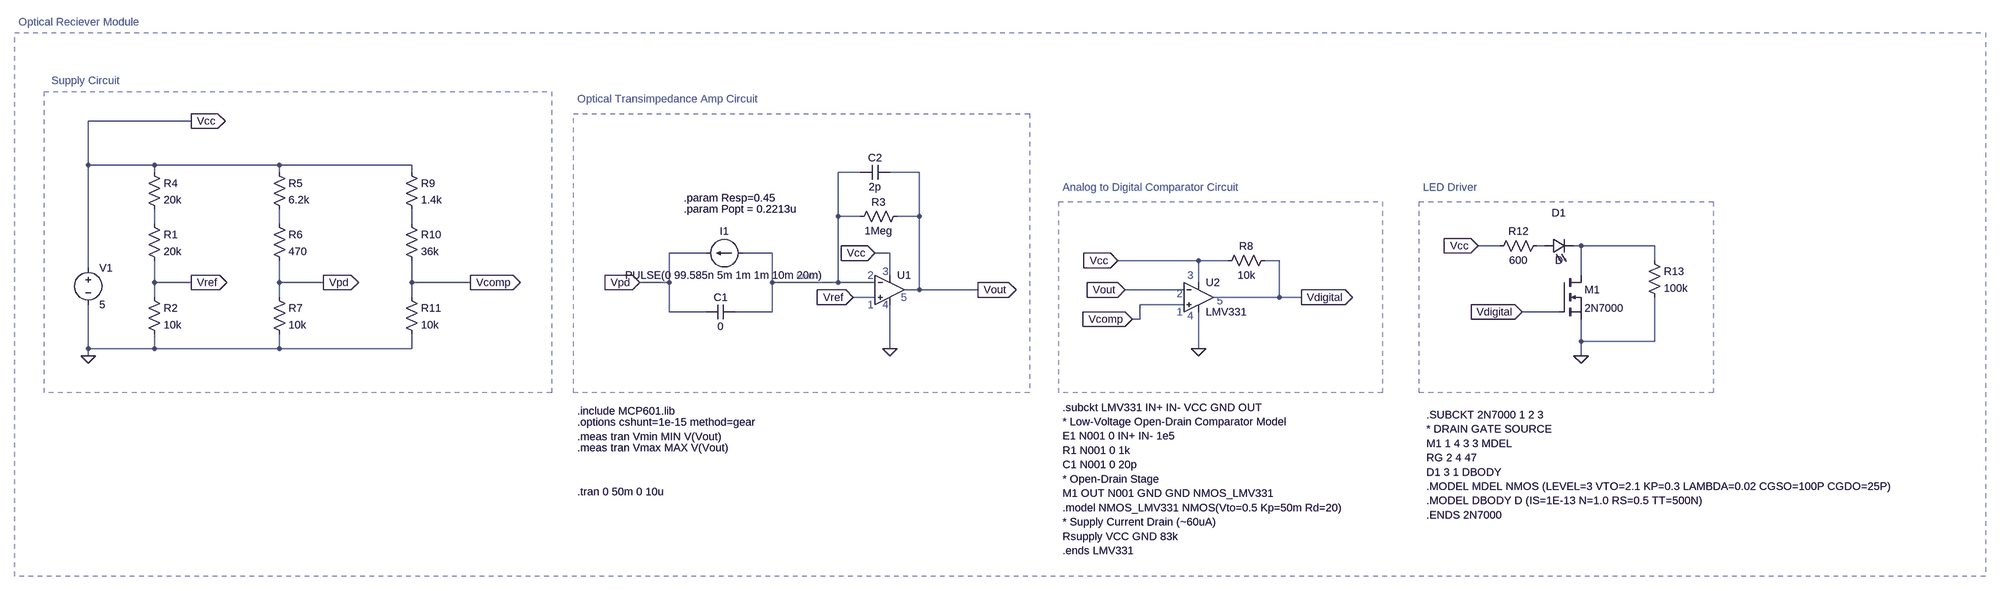
[diagram p0: schematic Optical TIA v2.asc]
Optical TIA v2.asc, the LTspice schematic file:
Version 4.1
SHEET 1 2564 1224
WIRE -1344 -400 -1568 -400
WIRE -1568 -304 -1568 -400
WIRE -1424 -304 -1568 -304
WIRE -1152 -304 -1424 -304
WIRE -864 -304 -1152 -304
WIRE -1424 -288 -1424 -304
WIRE -1152 -288 -1152 -304
WIRE -864 -288 -864 -304
WIRE 112 -288 64 -288
WIRE 240 -288 176 -288
WIRE 64 -192 64 -288
WIRE 112 -192 64 -192
WIRE 240 -192 240 -288
WIRE 240 -192 192 -192
WIRE -1424 -176 -1424 -208
WIRE -1152 -176 -1152 -208
WIRE -864 -176 -864 -208
WIRE 1504 -128 1456 -128
WIRE 1600 -128 1584 -128
WIRE 1680 -128 1664 -128
WIRE 1840 -128 1680 -128
WIRE -224 -112 -304 -112
WIRE -80 -112 -144 -112
WIRE 176 -112 144 -112
WIRE 848 -96 672 -96
WIRE 912 -96 848 -96
WIRE 1024 -96 992 -96
WIRE 1840 -96 1840 -128
WIRE -1568 -80 -1568 -304
WIRE 176 -64 176 -112
WIRE 1680 -64 1680 -128
WIRE -1424 -48 -1424 -96
WIRE -1344 -48 -1424 -48
WIRE -1152 -48 -1152 -96
WIRE -1056 -48 -1152 -48
WIRE -864 -48 -864 -96
WIRE -736 -48 -864 -48
WIRE -304 -48 -304 -112
WIRE -304 -48 -368 -48
WIRE -80 -48 -80 -112
WIRE 64 -48 64 -192
WIRE 64 -48 -80 -48
WIRE 144 -48 64 -48
WIRE 848 -48 848 -96
WIRE 240 -32 240 -192
WIRE 240 -32 208 -32
WIRE 368 -32 240 -32
WIRE 816 -32 688 -32
WIRE -1424 -16 -1424 -48
WIRE -1152 -16 -1152 -48
WIRE -864 -16 -864 -48
WIRE 144 -16 96 -16
WIRE 1024 -16 1024 -96
WIRE 1024 -16 880 -16
WIRE 1072 -16 1024 -16
WIRE 816 0 720 0
WIRE -304 16 -304 -48
WIRE -224 16 -304 16
WIRE -80 16 -80 -48
WIRE -80 16 -160 16
WIRE 1632 16 1552 16
WIRE 720 32 720 0
WIRE 720 32 704 32
WIRE 1680 80 1680 32
WIRE 1840 80 1840 -16
WIRE 1840 80 1680 80
WIRE -1568 96 -1568 0
WIRE -1424 96 -1424 64
WIRE -1424 96 -1568 96
WIRE -1152 96 -1152 64
WIRE -1152 96 -1424 96
WIRE -864 96 -864 64
WIRE -864 96 -1152 96
WIRE 176 96 176 0
WIRE 848 96 848 16
WIRE -1568 112 -1568 96
WIRE 1680 112 1680 80
FLAG 368 -32 Vout
IOPIN 368 -32 Out
FLAG -1344 -48 Vref
IOPIN -1344 -48 Out
FLAG -1344 -400 Vcc
IOPIN -1344 -400 Out
FLAG 144 -112 Vcc
IOPIN 144 -112 In
FLAG -1568 112 0
FLAG 176 96 0
FLAG 96 -16 Vref
IOPIN 96 -16 In
FLAG -1056 -48 Vpd
IOPIN -1056 -48 Out
FLAG -368 -48 Vpd
IOPIN -368 -48 In
FLAG -736 -48 Vcomp
IOPIN -736 -48 Out
FLAG 688 -32 Vout
IOPIN 688 -32 In
FLAG 1072 -16 Vdigital
IOPIN 1072 -16 Out
FLAG 704 32 Vcomp
IOPIN 704 32 In
FLAG 672 -96 Vcc
IOPIN 672 -96 In
FLAG 848 96 0
FLAG 1552 16 Vdigital
IOPIN 1552 16 In
FLAG 1680 112 0
FLAG 1456 -128 Vcc
IOPIN 1456 -128 In
SYMBOL OpAmps\\UniversalOpAmp2 176 -32 R0
SYMATTR InstName U1
SYMATTR Value2 Avol=1Meg GBW=2.8Meg Slew=2.3Meg
SYMATTR SpiceLine Ilimit=25m Rail=0.05 Vos=5mV
SYMBOL voltage -1568 -96 R0
WINDOW 123 0 0 Left 0
WINDOW 39 0 0 Left 0
SYMATTR InstName V1
SYMATTR Value 5
SYMBOL res -1440 -192 R0
SYMATTR InstName R1
SYMATTR Value 20k
SYMBOL res -1440 -32 R0
SYMATTR InstName R2
SYMATTR Value 10k
SYMBOL res 208 -208 R90
WINDOW 0 0 56 VBottom 2
WINDOW 3 32 56 VTop 2
SYMATTR InstName R3
SYMATTR Value 1Meg
SYMBOL cap -160 0 R90
WINDOW 0 0 32 VBottom 2
WINDOW 3 32 32 VTop 2
SYMATTR InstName C1
SYMATTR Value 0
SYMBOL res -1440 -304 R0
SYMATTR InstName R4
SYMATTR Value 20k
SYMBOL res -1168 -304 R0
SYMATTR InstName R5
SYMATTR Value 6.2k
SYMBOL res -1168 -192 R0
SYMATTR InstName R6
SYMATTR Value 470
SYMBOL res -1168 -32 R0
SYMATTR InstName R7
SYMATTR Value 10k
SYMBOL current -144 -112 R90
WINDOW 0 -32 40 VBottom 2
WINDOW 3 32 40 VTop 2
WINDOW 123 -4 40 VBottom 2
WINDOW 39 0 0 Left 0
SYMATTR InstName I1
SYMATTR Value PULSE(0 99.585n 5m 1m 1m 10m 20m)
SYMBOL cap 176 -304 R90
WINDOW 0 0 32 VBottom 2
WINDOW 3 32 32 VTop 2
SYMATTR InstName C2
SYMATTR Value 2p
SYMBOL OpAmps\\opamp2 848 -80 R0
SYMATTR InstName U2
SYMATTR Value LMV331
SYMBOL res -880 -304 R0
SYMATTR InstName R9
SYMATTR Value 1.4k
SYMBOL res -880 -192 R0
SYMATTR InstName R10
SYMATTR Value 36k
SYMBOL res -880 -32 R0
SYMATTR InstName R11
SYMATTR Value 10k
SYMBOL res 1008 -112 R90
WINDOW 0 0 56 VBottom 2
WINDOW 3 32 56 VTop 2
SYMATTR InstName R8
SYMATTR Value 10k
SYMBOL nmos 1632 -64 R0
SYMATTR InstName M1
SYMATTR Value 2N7000
SYMATTR Prefix X
SYMBOL LED 1600 -112 R270
WINDOW 0 72 32 VTop 2
WINDOW 3 0 32 VBottom 2
SYMATTR InstName D1
SYMBOL res 1600 -144 R90
WINDOW 0 0 56 VBottom 2
WINDOW 3 32 56 VTop 2
SYMATTR InstName R12
SYMATTR Value 600
SYMBOL res 1824 -112 R0
SYMATTR InstName R13
SYMATTR Value 100k
TEXT -504 232 Left 2 !.include MCP601.lib
TEXT -504 256 Left 2 !.options cshunt=1e-15 method=gear
TEXT 128 0 Left 2 ;1
TEXT 128 -64 Left 2 ;2
TEXT 160 -72 Left 2 ;3
TEXT 160 0 Left 2 ;4
TEXT 200 -16 Left 2 ;5
TEXT -504 312 Left 2 !.meas tran Vmax MAX V(Vout)
TEXT -504 288 Left 2 !.meas tran Vmin MIN V(Vout)
TEXT -272 -208 Left 2 !.param Popt = 0.2213u
TEXT -272 -232 Left 2 !.param Resp=0.45
TEXT -504 408 Left 2 !.tran 0 50m 0 10u
TEXT 552 224 Left 2 !.subckt LMV331 IN+ IN- VCC GND OUT\n* Low-Voltage Open-Drain Comparator Model\nE1 N001 0 IN+ IN- 1e5\nR1 N001 0 1k\nC1 N001 0 20p\n* Open-Drain Stage\nM1 OUT N001 GND GND NMOS_LMV331\n.model NMOS_LMV331 NMOS(Vto=0.5 Kp=50m Rd=20)\n* Supply Current Drain (~60uA)\nRsupply VCC GND 83k\n.ends LMV331
TEXT 800 16 Left 2 ;1
TEXT 800 -24 Left 2 ;2
TEXT 824 -64 Left 2 ;3
TEXT 824 24 Left 2 ;4
TEXT 888 -8 Left 2 ;5
TEXT 1344 240 Left 2 !.SUBCKT 2N7000 1 2 3\n* DRAIN GATE SOURCE\nM1 1 4 3 3 MDEL\nRG 2 4 47\nD1 3 1 DBODY\n.MODEL MDEL NMOS (LEVEL=3 VTO=2.1 KP=0.3 LAMBDA=0.02 CGSO=100P CGDO=25P)\n.MODEL DBODY D (IS=1E-13 N=1.0 RS=0.5 TT=500N)\n.ENDS 2N7000
TEXT -1648 -488 Left 2 ;Supply Circuit
TEXT -504 -448 Left 2 ;Optical Transimpedance Amp Circuit
TEXT 552 -256 Left 2 ;Analog to Digital Comparator Circuit
TEXT 1336 -256 Left 2 ;LED Driver
TEXT -1720 -616 Left 2 ;Optical Reciever Module
RECTANGLE Normal -560 192 -1664 -464 2
RECTANGLE Normal 480 192 -512 -416 2
RECTANGLE Normal 1248 192 544 -224 2
RECTANGLE Normal 1968 192 1328 -224 2
RECTANGLE Normal 2560 592 -1728 -592 2

The netlist it stands for:
* Optical TIA v2.asc
X§U1 Vref N001 Vcc 0 Vout level2 Avol=1Meg GBW=2.8Meg Slew=2.3Meg Ilimit=25m Rail=0.05 Vos=5mV En=0 Enk=0 In=0 Ink=0 Rin=500Meg  ; pins In+ In- V+ V- OUT
V1 Vcc 0 5
R1 N002 Vref 20k
R2 Vref 0 10k
R3 Vout N001 1Meg
C1 N001 Vpd 0
R4 Vcc N002 20k
R5 Vcc N003 6.2k
R6 N003 Vpd 470
R7 Vpd 0 10k
I1 N001 Vpd PULSE(0 99.585n 5m 1m 1m 10m 20m)
C2 Vout N001 2p
X§U2 Vcomp Vout Vcc 0 Vdigital LMV331  ; pins In+ In- V+ V- OUT
R9 Vcc N004 1.4k
R10 N004 Vcomp 36k
R11 Vcomp 0 10k
R8 Vdigital Vcc 10k
X§M1 N006 Vdigital 0 2N7000  ; pins D G S
D1 N005 N006 D
R12 N005 Vcc 600
R13 N006 0 100k
.model D D
.lib standard.dio
.include MCP601.lib
.options cshunt=1e-15 method=gear
* 1
* 2
* 3
* 4
* 5
.meas tran Vmax MAX V(Vout)
.meas tran Vmin MIN V(Vout)
.param Popt = 0.2213u
.param Resp=0.45
.tran 0 50m 0 10u
.subckt LMV331 IN+ IN- VCC GND OUT
* Low-Voltage Open-Drain Comparator Model
E1 N001 0 IN+ IN- 1e5
R1 N001 0 1k
C1 N001 0 20p
* Open-Drain Stage
M1 OUT N001 GND GND NMOS_LMV331
.model NMOS_LMV331 NMOS(Vto=0.5 Kp=50m Rd=20)
* Supply Current Drain (~60uA)
Rsupply VCC GND 83k
.ends LMV331
* 1
* 2
* 3
* 4
* 5
.SUBCKT 2N7000 1 2 3
* DRAIN GATE SOURCE
M1 1 4 3 3 MDEL
RG 2 4 47
D1 3 1 DBODY
.MODEL MDEL NMOS (LEVEL=3 VTO=2.1 KP=0.3 LAMBDA=0.02 CGSO=100P CGDO=25P)
.MODEL DBODY D (IS=1E-13 N=1.0 RS=0.5 TT=500N)
.ENDS 2N7000
* Supply Circuit
* Optical Transimpedance Amp Circuit
* Analog to Digital Comparator Circuit
* LED Driver
* Optical Reciever Module
.lib UniversalOpAmp2.lib
.backanno
.end